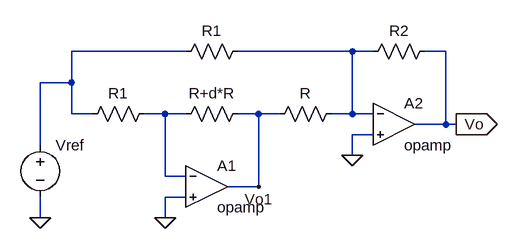
[diagram p0: schematic 3d1.asc]
3d1.asc, the LTspice schematic file:
Version 4
SHEET 1 880 680
WIRE 192 0 16 0
WIRE 448 0 272 0
WIRE 480 0 448 0
WIRE 592 0 560 0
WIRE 16 48 16 0
WIRE 16 48 -32 48
WIRE 16 96 16 48
WIRE 48 96 16 96
WIRE 160 96 128 96
WIRE 192 96 160 96
WIRE 304 96 272 96
WIRE 336 96 304 96
WIRE 448 96 448 0
WIRE 448 96 416 96
WIRE 480 96 448 96
WIRE 592 112 592 0
WIRE 592 112 544 112
WIRE 608 112 592 112
WIRE 480 128 448 128
WIRE -32 144 -32 48
WIRE 448 160 448 128
WIRE 160 192 160 96
WIRE 192 192 160 192
WIRE 304 208 304 96
WIRE 304 208 256 208
WIRE 192 224 160 224
WIRE -32 256 -32 224
WIRE 160 256 160 224
FLAG 160 256 0
FLAG 448 160 0
FLAG -32 256 0
FLAG 608 112 Vo
IOPIN 608 112 Out
FLAG 304 208 Vo1
SYMBOL Opamps\\opamp 224 144 R0
SYMATTR InstName A1
SYMBOL Opamps\\opamp 512 48 R0
SYMATTR InstName A2
SYMBOL res 144 80 R90
WINDOW 0 0 56 VBottom 2
WINDOW 3 32 56 Invisible 2
SYMATTR InstName R1
SYMBOL res 288 80 R90
WINDOW 0 0 56 VBottom 2
WINDOW 3 32 56 Invisible 2
SYMATTR InstName R+d*R
SYMBOL res 432 80 R90
WINDOW 0 0 56 VBottom 2
WINDOW 3 32 56 Invisible 2
SYMATTR InstName R
SYMBOL res 288 -16 R90
WINDOW 0 0 56 VBottom 2
WINDOW 3 32 56 Invisible 2
SYMATTR InstName R1
SYMBOL res 576 -16 R90
WINDOW 0 0 56 VBottom 2
WINDOW 3 32 56 Invisible 2
SYMATTR InstName R2
SYMBOL voltage -32 128 R0
WINDOW 3 24 96 Invisible 2
SYMATTR InstName Vref

The netlist it stands for:
* 3d1.asc
XA1 N003 0 Vo1 opamp Aol=100K GBW=10Meg  ; pins invin noninvin out
XA2 N002 0 Vo opamp Aol=100K GBW=10Meg  ; pins invin noninvin out
R1 N003 N001 R
R+d*R Vo1 N003 R
R N002 Vo1 R
R1 N002 N001 R
R2 Vo N002 R
Vref N001 0 V
.backanno
.end